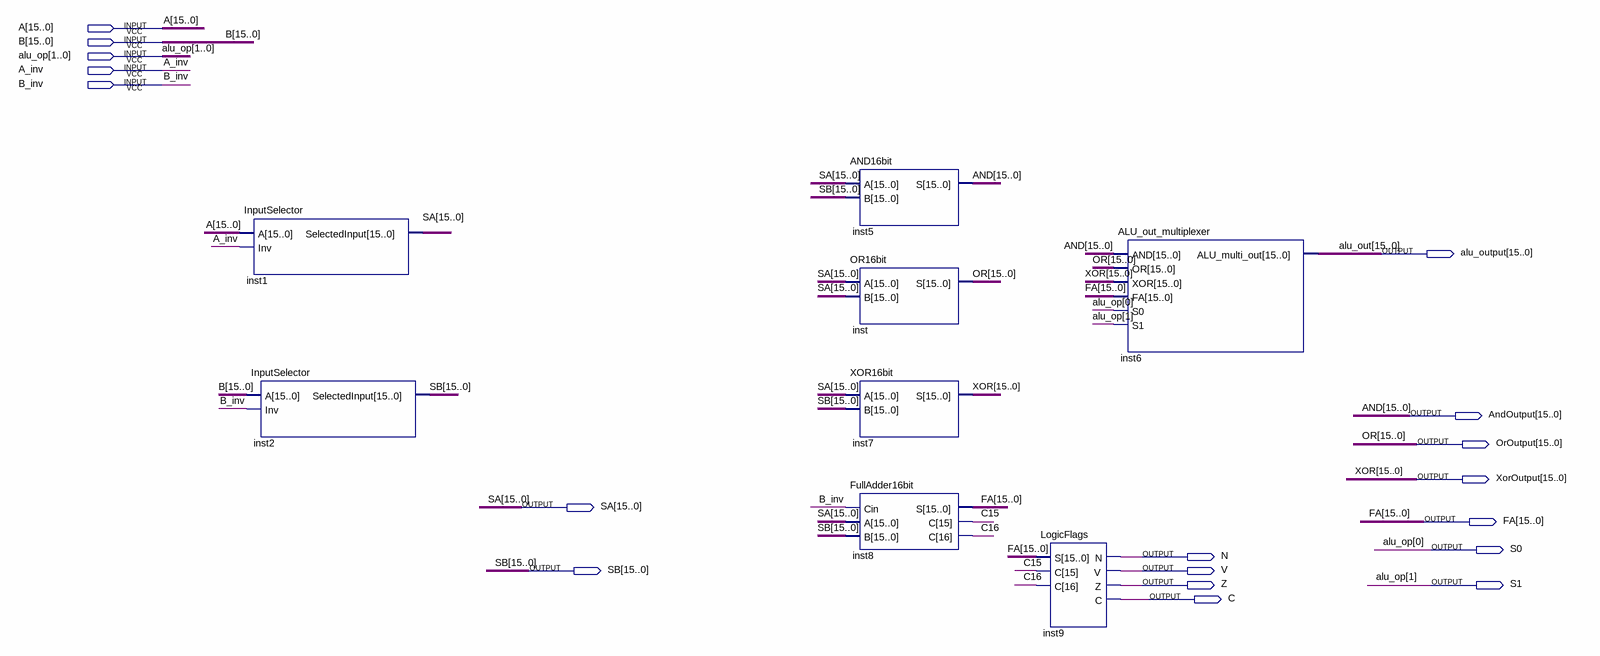
[diagram p0: schematic sheet]
// Quartus schematic ALU_Complete.bdf as structural Verilog: 8 symbols, 18 pins
module ALU_Complete (
  input  [15:0] A,
  input  [15:0] B,
  input  [1:0] alu_op,
  input  A_inv,
  input  B_inv,
  output [15:0] alu_output,
  output [15:0] AndOutput,
  output [15:0] OrOutput,
  output [15:0] XorOutput,
  output [15:0] SA,
  output [15:0] FA,
  output S0,
  output N,
  output [15:0] SB,
  output V,
  output Z,
  output S1,
  output C
);

  wire C15, C16;

  InputSelector inst1 (.A(A), .Inv(A_inv), .SelectedInput(SA));
  InputSelector inst2 (.A(B), .Inv(B_inv), .SelectedInput(SB));
  AND16bit inst5 (.A(SA), .B(SB), .S(AndOutput));
  OR16bit inst (.A(SA), .B(SA), .S(OrOutput));
  XOR16bit inst7 (.A(SA), .B(SB), .S(XorOutput));
  FullAdder16bit inst8 (.Cin(B_inv), .A(SA), .B(SB), .S(FA), .C({C16, C15}));
  LogicFlags inst9 (.S(FA), .C({C16, C15, C}), .N(N), .V(V), .Z(Z));
  ALU_out_multiplexer inst6 (
    .AND(AndOutput), .OR(OrOutput), .XOR(XorOutput), .FA(FA), .S0(alu_op[0]), .S1(alu_op[1]),
    .ALU_multi_out(alu_output));

  assign S0 = alu_op[0];
  assign S1 = alu_op[1];

  // Other names for the same wires on the sheet: alu_out[15:0] = alu_output; AND[15:0] = AndOutput;
  //   OR[15:0] = OrOutput; XOR[15:0] = XorOutput
endmodule
